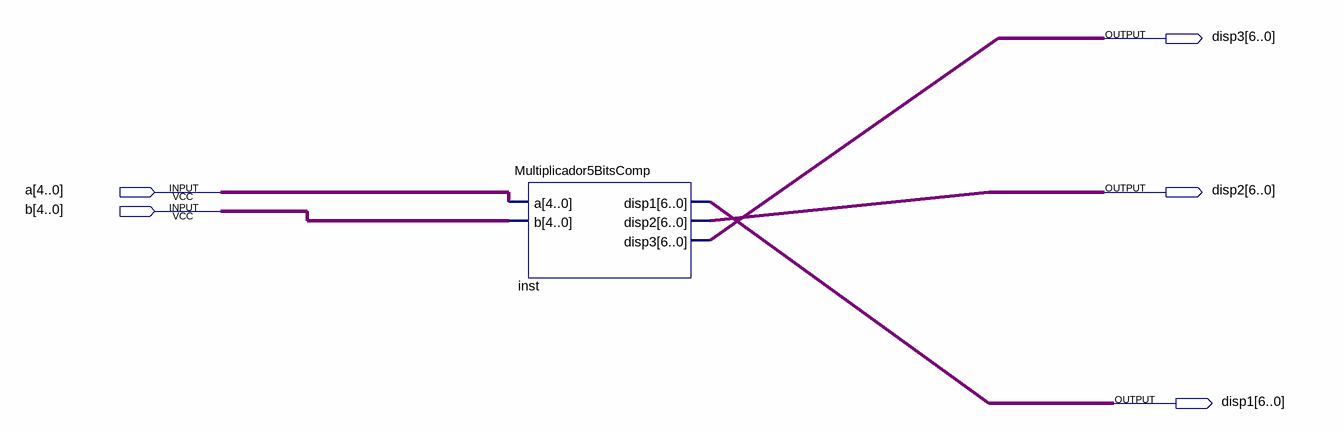
[diagram p0: schematic sheet]
// Quartus schematic Practica6.bdf as structural Verilog: 1 symbols, 5 pins
module Practica6 (
  input  [4:0] a,
  input  [4:0] b,
  output [6:0] disp3,
  output [6:0] disp2,
  output [6:0] disp1
);

  Multiplicador5BitsComp inst (.a(a), .b(b), .disp1(disp1), .disp2(disp2), .disp3(disp3));
endmodule
